# EasyEDA Pro project head_board.epro, board PCB1
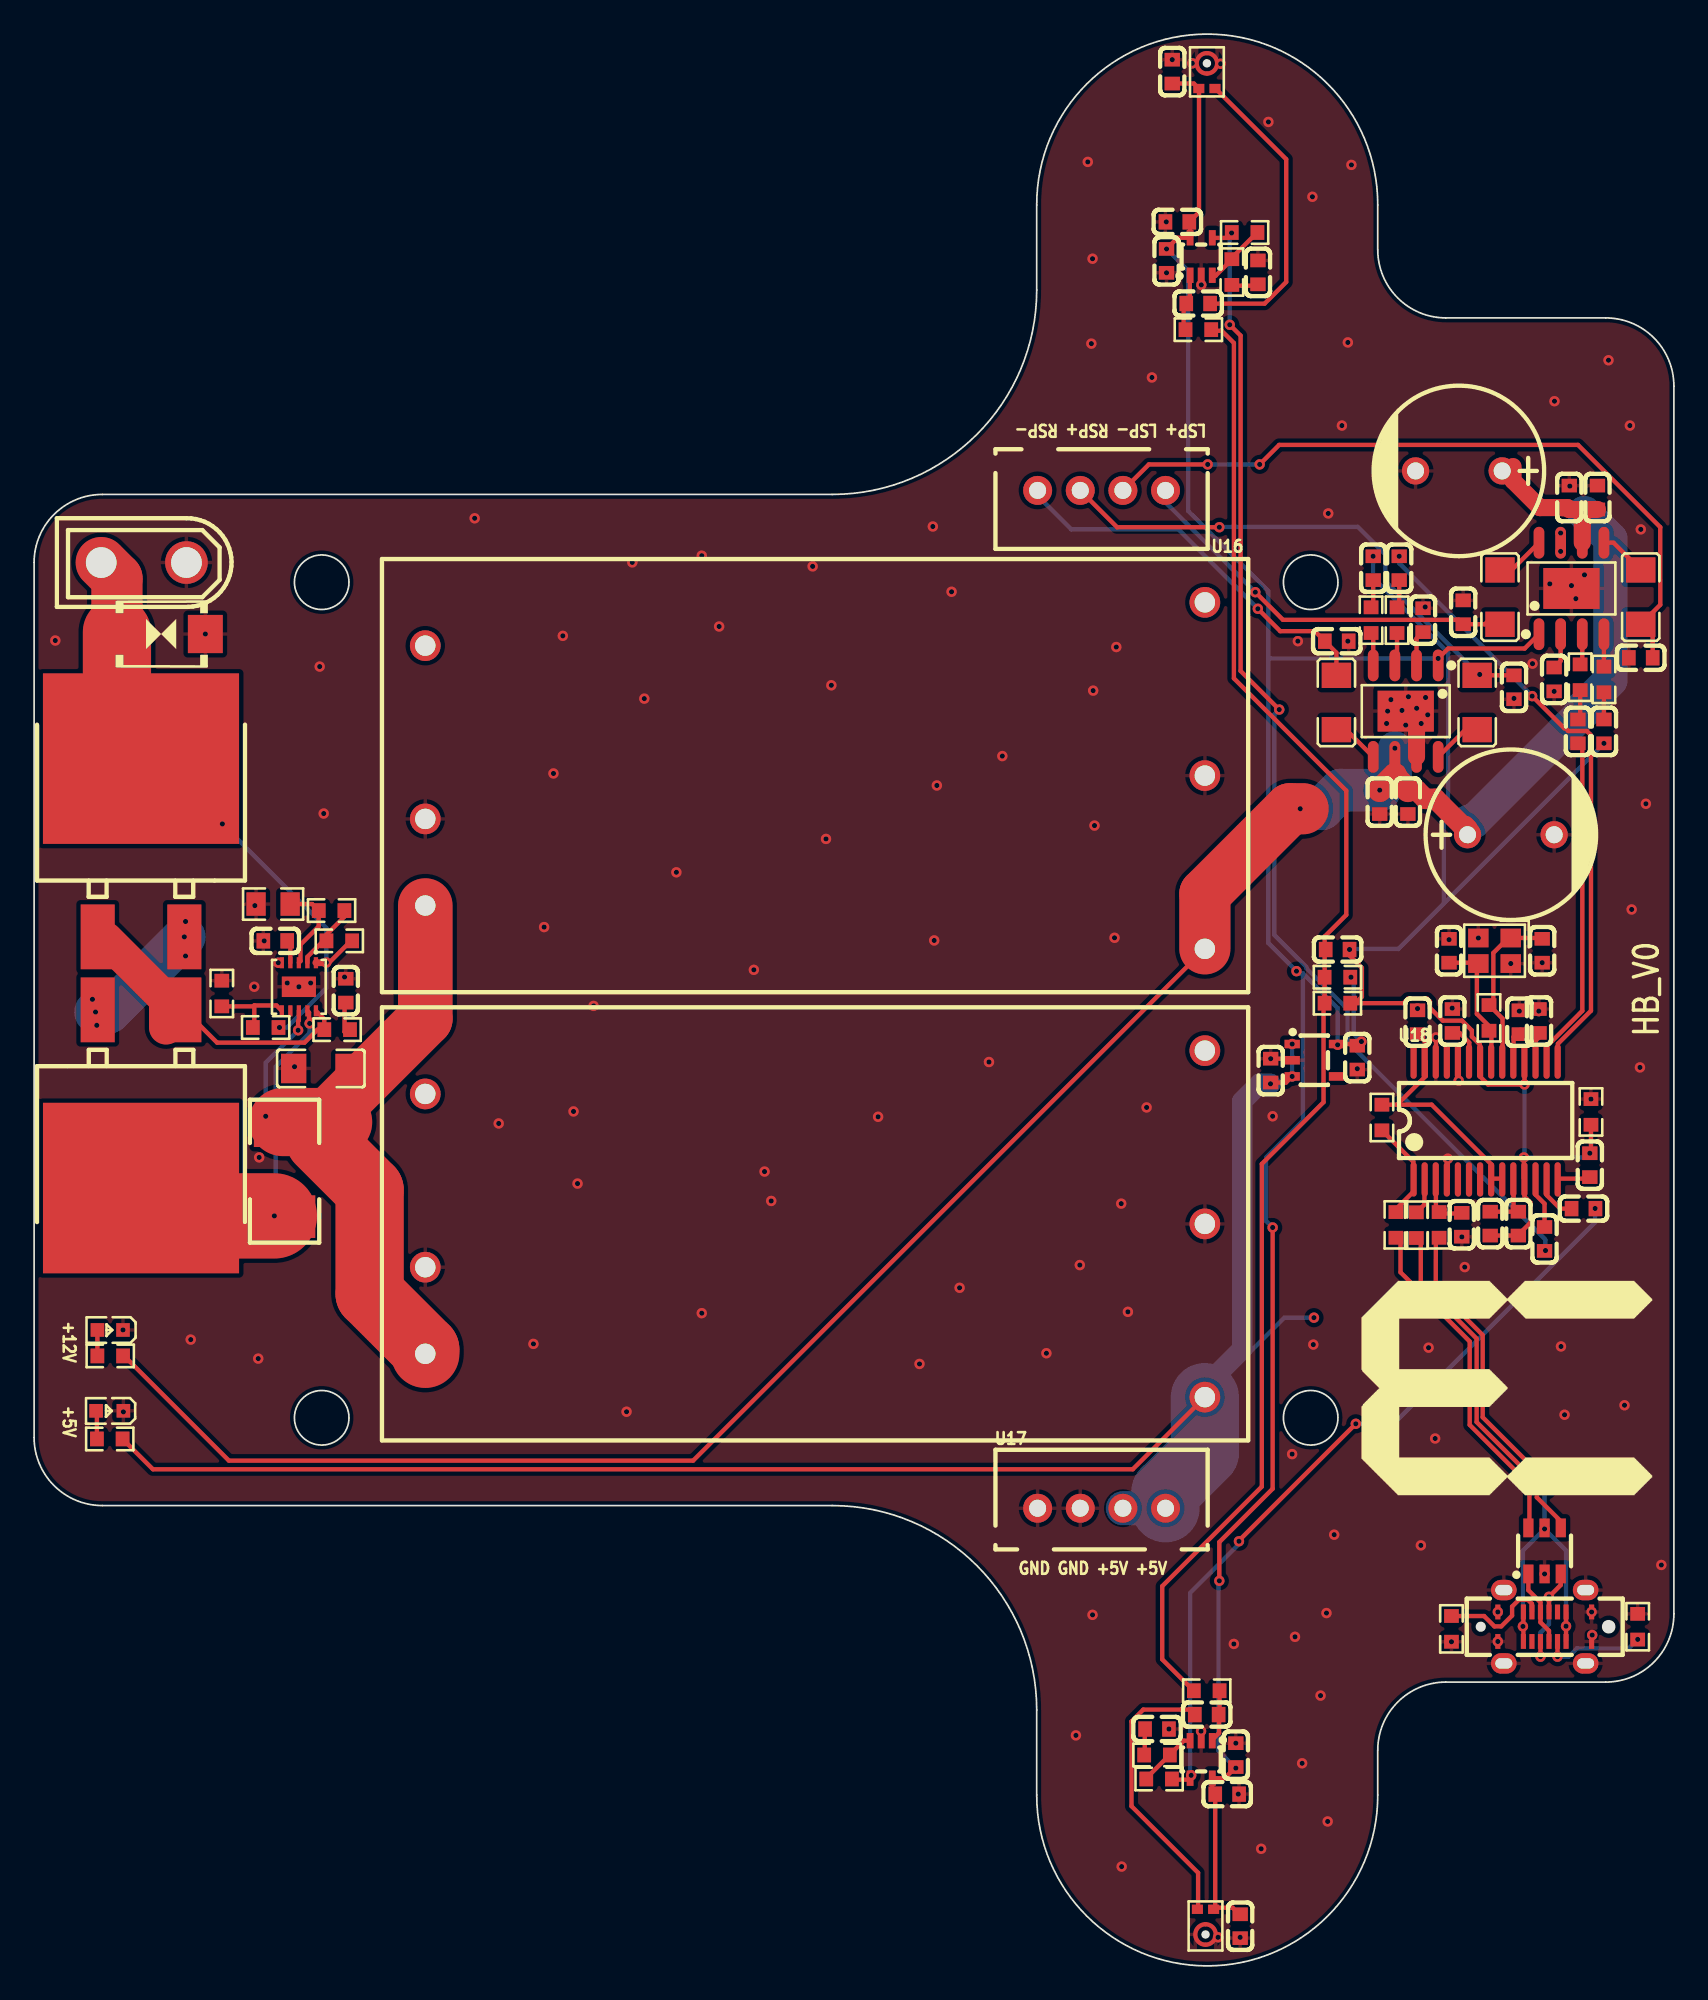
[diagram p1: board, top side]
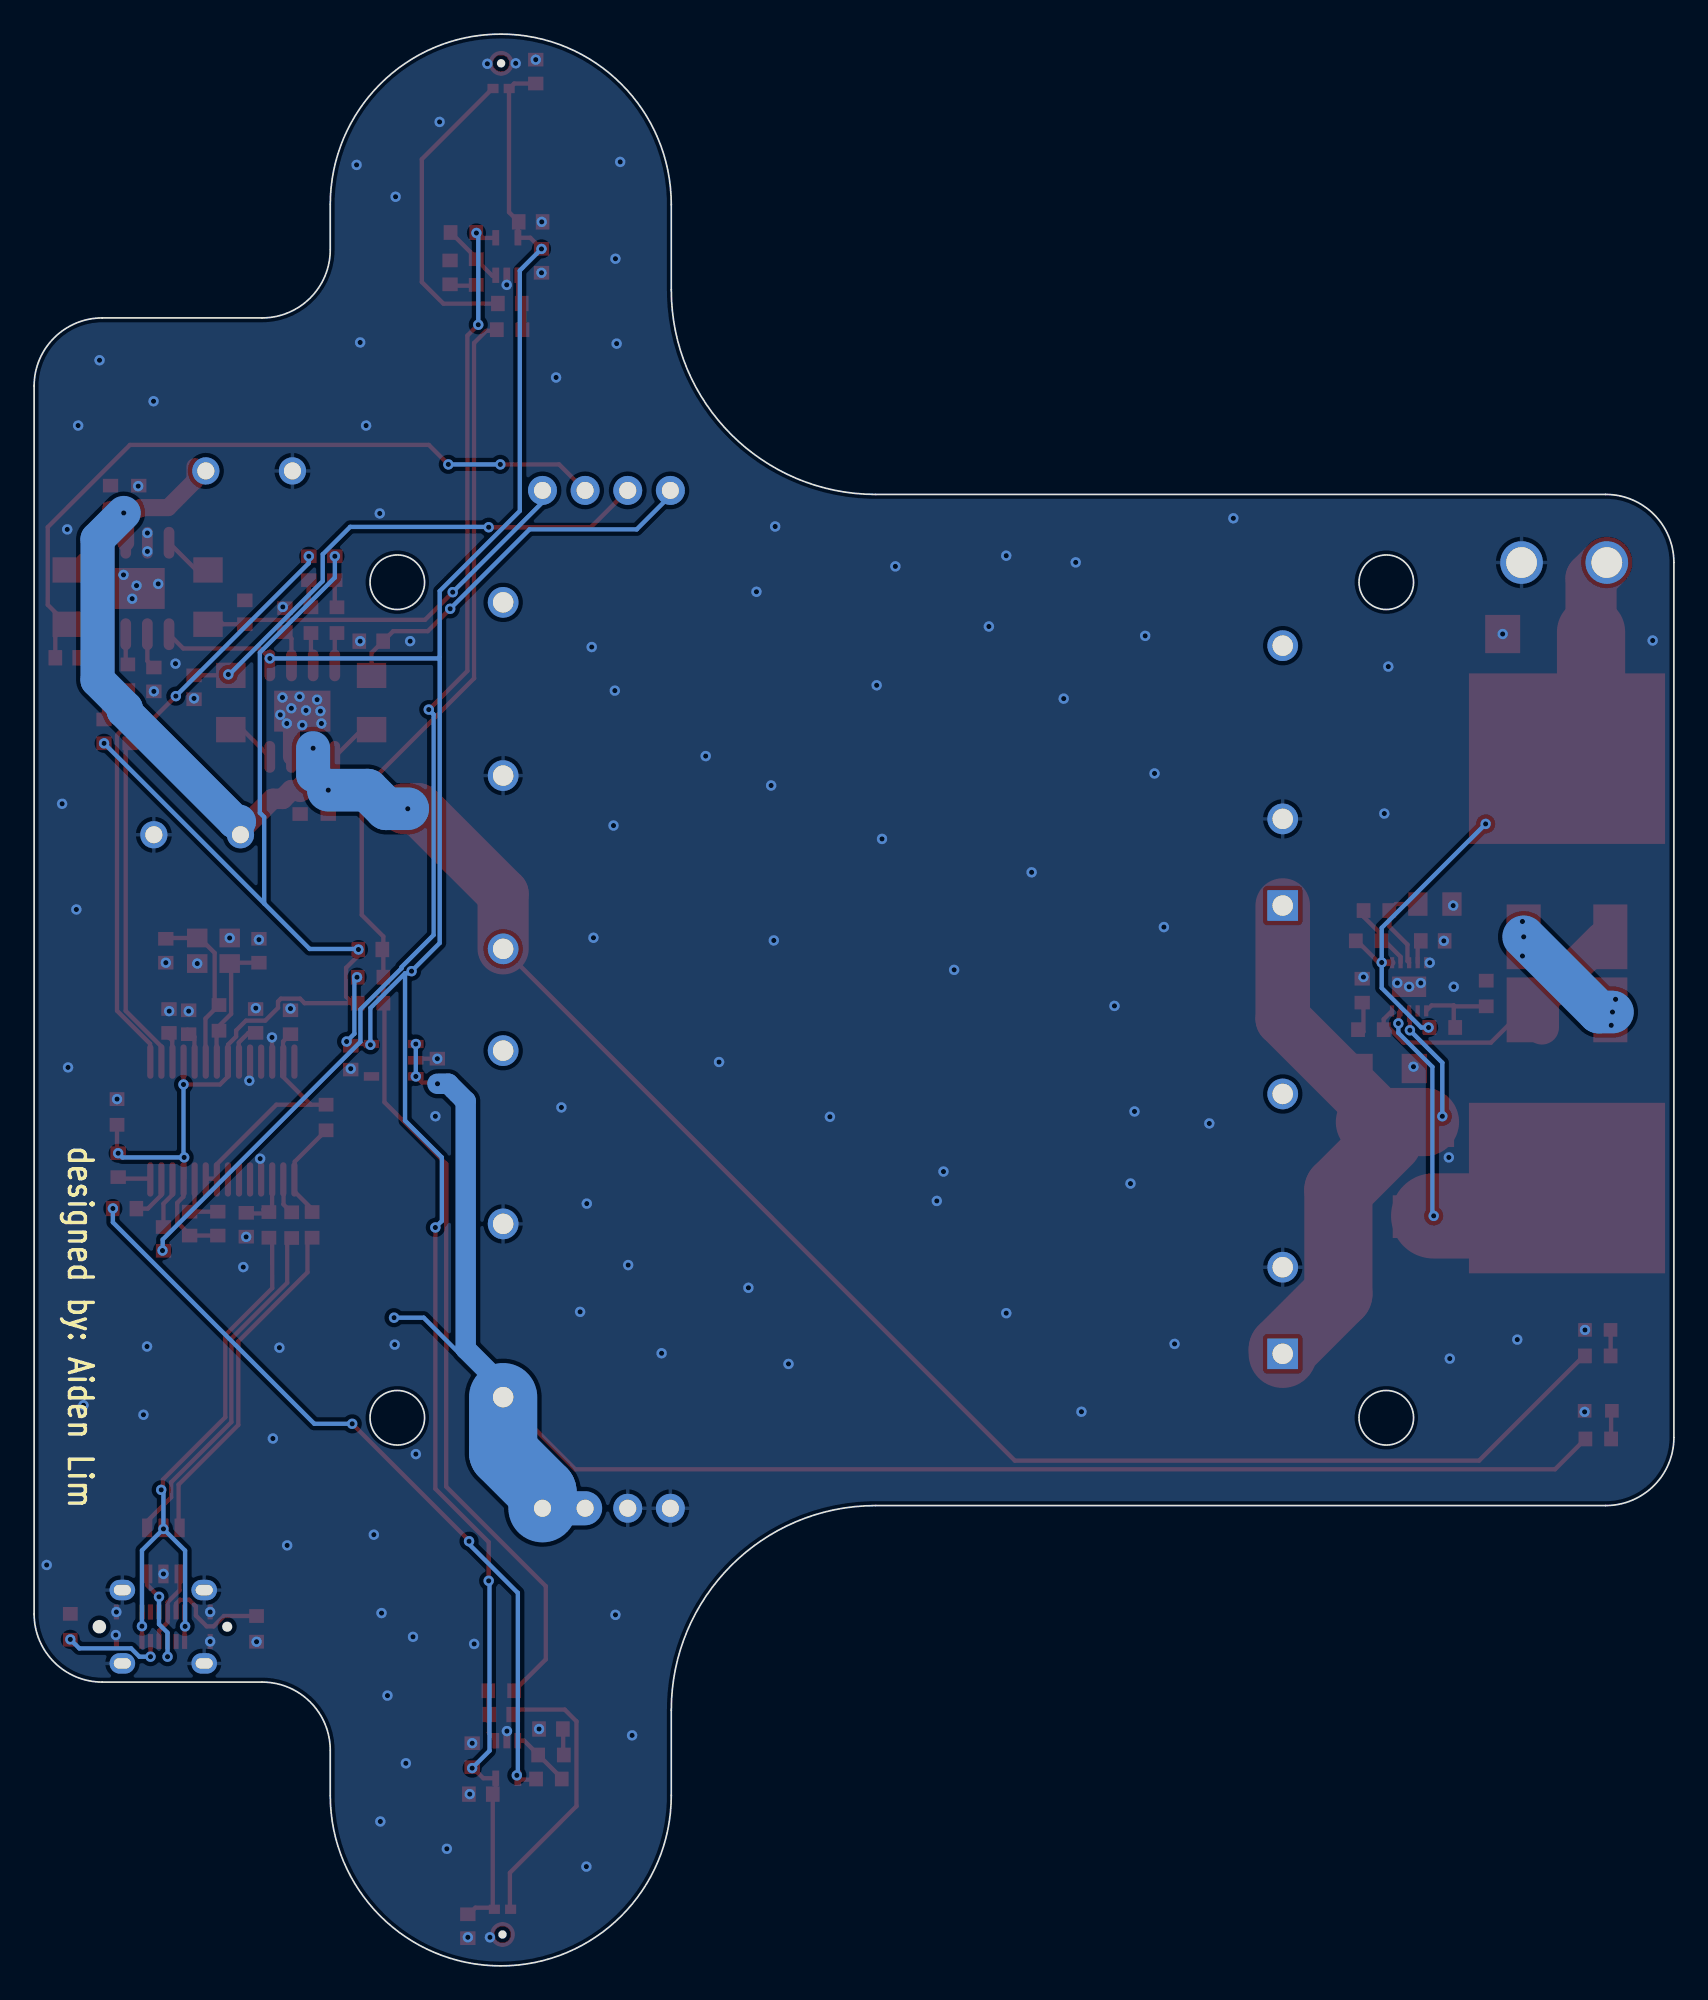
[diagram p2: board, bottom side, seen from below]

Outline 96.17 x 113.29 mm; copper layers: Top Layer, Bottom Layer. Coordinates in mm from the lower left corner of the outline.
Outline path: circle c16.87,81.14 r1.6 ; circle c16.87,32.14 r1.6 ; circle c74.87,81.14 r1.6 ; circle c74.87,32.14 r1.6 ; 0,82.29 0,30.99 arc(1.17,28.17) 4,26.99 46.8,26.99 arc(55.29,23.48) 58.8,14.99 58.8,10 arc(68.8,0) 78.8,10 78.8,12.64 arc(79.97,15.47) 82.8,16.64 92.17,16.64 arc(95,17.81) 96.17,20.64 96.17,92.64 arc(95,95.47) 92.17,96.64 82.8,96.64 arc(79.97,97.81) 78.8,100.64 78.8,103.29 arc(68.8,113.29) 58.8,103.29 58.8,98.29 arc(55.29,89.81) 46.8,86.29 4,86.29 arc(1.17,85.12) 0,82.29
Stack: Top Layer 0.035mm / Dielectric1 1.51mm FR4 er 4.5 / Bottom Layer 0.035mm

## Design rules (mm)
net D+: DP1
net D-: DP1
template: Custom Config
spacing copperThickness1oz (default): track to track 0.102, other pairs 0.152 to 0.3
spacing copperThickness2oz: track to track 0.203, other pairs 0.152 to 0.3
track width copperThickness1oz (default): min 0.127, default 0.254, max 6
track width copperThickness2oz: min 0.203, default 0.254, max 2.54
differential pair differentialPair (default): width min 0.127, default 0.254, max 2.54; gap min 0.152, default 0.152
via viaSize (default): diameter min 0.3, default 0.61, max 10; hole min 0.2, default 0.305, max 6.3

## Placement (name value [footprint] x y rotation side)
C1  10uF  [C0603]  71.78 99.31 270 top
C2  100nF  [C0603]  66.75 111.09 90 top
C3  1uF  [C0603]  66.41 99.99 90 top
C4  100nF  [C0603]  67.05 102.28 180 top
C5  4.7uF  [C0603]  77.6 53.26 90 top
C6  10uF  [C0603]  72.52 52.5 90 top
C7  100nF  [C0603]  68.27 97.49 0 top
C8  1uF  [C0603]  76.45 59.6 180 top
C9  10uF  [C0603]  65.86 13.89 180 top
C10  1uF  [C0603]  81.13 55.34 90 top
C11  100nF  [C0603]  70.73 2.33 270 top
C12  1uF  [C0603]  70.48 12.36 270 top
C13  100nF  [C0603]  69.97 10.07 0 top
C14  1uF  [C0603]  83.73 43.46 90 top
C15  1uF  [C0603]  83.18 55.41 90 top
C16  12pF  [C0603]  82.98 59.53 90 top
C17  100nF  [C0603]  68.77 14.74 180 top
C18  1uF  [C0603]  87.1 55.34 90 top
C19  12pF  [C0603]  88.44 59.53 270 top
C20  100nF  [C0603]  85.4 43.53 90 top
C21  10uF  [C0603]  87.05 43.53 270 top
C22  1uF  [C0603]  88.26 55.41 90 top
C23  1uF  [C0603]  88.58 42.63 90 top
C24  1uF  [C0603]  90.87 44.41 180 top
C25  10uF  [C0603]  91.24 46.96 90 top
C26  1nF  [C0603]  86.79 74.98 270 top
C27  1uF  [C0603]  81.46 78.92 270 top
C28  1uF  [C0603]  78.92 68.25 90 top
C29  1nF  [C0603]  80.57 68.25 90 top
C30  470uF  [CAP-TH_BD10.0-P5.00-D1.0-FD]  86.61 66.33 0 top
C32  100nF  [C0603]  80.06 81.97 270 top
C33  100nF  [C0603]  78.53 81.97 270 top
C34  1nF  [C0603]  76.4 77.69 180 top
C36  1uF  [C1206]  16.82 52.63 0 top
C37  220nF  [C0603]  14.14 60.11 0 top
C38  1uF  [C0603]  89.14 75.44 90 top
C39  1uF  [C0603]  91.68 86.11 270 top
C40  1nF  [C0603]  90.03 86.11 270 top
C41  470uF  [CAP-TH_BD10.0-P5.00-D1.0-FD]  83.56 87.67 180 top
C42  100nF  [C0603]  90.54 72.39 90 top
C43  100nF  [C0603]  92.07 72.39 90 top
C44  1nF  [C0603]  94.22 76.71 0 top
C45  1nF  [C0603]  83.81 79.38 90 top
C47  3.3nF  [C0603]  18.28 57.19 270 top
CN1  XT30UPB-M  [CONN-TH_XT30UPB-M]  6.44 82.3 180 top
D1  TPUSBLC6-2SC6  [SOT-23-6_L2.9-W1.6-P0.95-LS2.8-BR]  88.58 24.34 270 top
D2  SMBJ58CA  [SMB_L4.6-W3.6-LS5.4-BI]  7.45 78.11 0 top
FB1  BLM31PG601SN1L  [L1206]  84.63 74.09 90 top
FB2  BLM31PG601SN1L  [L1206]  76.38 74.09 270 top
FB3  BLM31PG601SN1L  [L1206]  94.22 80.27 90 top
FB4  BLM31PG601SN1L  [L1206]  85.97 80.27 270 top
LED1  KT-0603R  [LED0603-RD#2]  4.44 32.55 180 top
LED2  KT-0603B  [LED0603-RD]  4.47 37.29 180 top
Q1  XC6220B331MR-G  [SOT-25_L3.0-W1.6-P0.95-LS2.8-TL]  75.08 53.11 0 top
Q2  PSMN4R8-100BSEJ  [SOT404_L11.0-W10.0-P2.54-LS15.3-BR]  6.27 65.57 270 top
Q3  PSMN4R8-100BSEJ  [SOT404_L11.0-W10.0-P2.54-LS15.3-BR]  6.27 50.84 90 top
R1  5.1kΩ  [R0603]  94.04 19.89 90 top
R2  51kΩ  [R0603]  70.99 101.65 0 top
R3  1kΩ  [R0603]  70.24 99.33 270 top
R4  5.1kΩ  [R0603]  83.12 19.76 90 top
R5  10kΩ  [R0603]  76.44 57.98 0 top
R6  100kΩ  [R0603]  68.28 95.95 180 top
R7  10kΩ  [R0603]  76.44 56.46 180 top
R8  22Ω  [R0603]  81.06 43.44 90 top
R9  22Ω  [R0603]  79.86 43.45 90 top
R10  1.5kΩ  [R0603]  79.05 49.75 90 top
R11  51kΩ  [R0603]  65.98 10.96 180 top
R12  1kΩ  [R0603]  65.86 12.37 180 top
R13  2.2Ω  [R0603]  82.4 43.45 90 top
R14  1MΩ  [R0603]  85.32 55.59 270 top
R15  100kΩ  [R0603]  68.77 16.13 0 top
R16  20kΩ  [R0603]  79.93 78.92 270 top
R17  20kΩ  [R0603]  78.41 78.92 270 top
R18  22kΩ  [R0603]  17.77 54.9 180 top
R19  1kΩ  [R0603]  4.44 30.9 180 top
R20  3kΩ  [R0603]  4.47 35.77 0 top
R22  5mΩ  [RES-SMD_L6.4-W3.2_LR2512D-3W-1MR]  14.69 46.6 270 top
R23  9.53kΩ  [R0603]  17.45 61.89 0 top
R24  20kΩ  [R0805]  14.02 62.27 0 top
R26  1MΩ  [R0603]  13.58 55.03 0 top
R27  100kΩ  [R0603]  11.01 57.02 90 top
R28  20kΩ  [R0603]  92.07 75.44 90 top
R29  20kΩ  [R0603]  90.67 75.57 90 top
R30  0Ω  [R0603]  91.31 50.08 270 top
R31  2.37MΩ  [R0603]  17.9 60.11 0 top
U1  TYPE-C 16P LTH6.8  [USB-C-SMD_TYPE-C-16P-LTH6.8]  88.59 19.89 0 top
U2  GTA2718B-3HA  [MIC-SMD_3P-L2.8-W1.9_AP1688]  68.78 110.83 180 top
U3  TLV9061IDCKR  [SC-70-5_L2.1-W1.3-P0.65-LS2.2-BR]  68.45 100.24 270 top
U5  GTA2718B-3HA  [MIC-SMD_3P-L2.8-W1.9_AP1688]  68.7 2.58 0 top
U6  TLV9061IDCKR  [SC-70-5_L2.1-W1.3-P0.65-LS2.2-BR]  68.45 12.11 90 top
U7  NS4110B  [ESOP-8_L4.9-W3.9-P1.27-LS6.0-BL-EP-1]  80.44 73.58 180 top
U9  LTC4368CDD-2#PBF  [DFN-10_L3.0-W3.0-P0.50-BL-EP]  15.53 57.42 180 top
U10  100kHz  [PWRM-TH_TURBXXXXLD-30WR3]  45.8 43.51 0 top
U13  300kHz  [PWRM-TH_TURBXXXXLD-30WR3]  45.8 69.8 0 top
U14  NS4110B  [ESOP-8_L4.9-W3.9-P1.27-LS6.0-BL-EP-1]  90.16 80.78 0 top
U16  B4B-XH-A(LF)(SN)  [CONN-TH_B4B-XH-A-LF-SN]  62.6 86.53 180 top
U17  B4B-XH-A(LF)(SN)  [CONN-TH_B4B-XH-A-LF-SN]  62.6 26.84 0 top
U18  PCM2900CDBR  [SSOP-28_L10.2-W5.3-P0.65-LS7.8-BL]  85.13 49.58 0 top
X1  12MHz  [CRYSTAL-SMD_4P-L2.5-W2.0-BL-2]  85.65 59.53 180 top

## Footprints (pads in the part's own frame, mm; a bottom-side part is the same pattern mirrored in y, then rotated)
C0603
  rect 0.8x0.9 smd: 1(-0.7,0) 2(0.7,0)
C1206
  rect 1.485x1.728 smd: 1(-1.593,0) 2(1.593,0)
CAP-TH_BD10.0-P5.00-D1.0-FD
  round 1.6 hole 1: 1(-2.54,0) 2(2.54,0)
CONN-TH_B4B-XH-A-LF-SN
  round 1.7 hole 1: 1(3.75,0) 2(1.25,0) 3(-1.25,0) 4(-3.75,0)
CONN-TH_XT30UPB-M
  round 2.5 hole 1.8: 1(-2.5,0) 2(2.5,0)
CRYSTAL-SMD_4P-L2.5-W2.0-BL-2
  rect 1.2x1.1 smd: 1(-0.95,-0.75) 2(0.95,-0.75) 3(0.95,0.75) 4(-0.95,0.75)
DFN-10_L3.0-W3.0-P0.50-BL-EP
  rect 0.25x0.65 smd: 1(-1,-1.411) 2(-0.5,-1.411) 3(0,-1.411) 4(0.5,-1.411) 5(1,-1.411) 6(1,1.411) 7(0.5,1.411) 8(0,1.411) 9(-0.5,1.411) 10(-1,1.411)
  rect 2x1.2 smd: 11(0,0)
ESOP-8_L4.9-W3.9-P1.27-LS6.0-BL-EP-1
  oval 0.63x1.865 smd: 1(-1.905,-2.683) 2(-0.635,-2.683) 3(0.635,-2.683) 4(1.905,-2.683) 5(1.905,2.683) 6(0.635,2.683) 7(-0.635,2.683) 8(-1.905,2.683)
  rect 3.3x2.4 smd: 9(0,0)
L1206
  rect 1.485x1.728 smd: 1(-1.593,0) 2(1.593,0)
LED0603-RD
  rect 0.8x0.8 smd: 1(-0.749,0) 2(0.749,0)
LED0603-RD#2
  rect 0.8x0.8 smd: 1(-0.799,0) 2(0.799,0)
MIC-SMD_3P-L2.8-W1.9_AP1688
  rect 0.65x0.545 smd: 1(0.475,0.739) 2(-0.475,0.739)
  custom 0.849x1.45 smd: 3(-0.6,-0.739) 3(0.6,-0.739)
PWRM-TH_TURBXXXXLD-30WR3
  rect 1.8x1.8 hole 1.2: 1(-22.86,-7.62)
  round 1.8 hole 1.2: 2(-22.86,-2.54) 3(-22.86,7.62) 4(22.86,10.16) 5(22.86,0) 6(22.86,-10.16)
R0603
  rect 0.806x0.864 smd: 1(-0.753,0) 2(0.753,0)
R0805
  rect 1.133x1.377 smd: 1(-1,0) 2(1,0)
RES-SMD_L6.4-W3.2_LR2512D-3W-1MR
  rect 2.5x3.6 smd: 1(-2.667,0) 2(2.667,0)
SC-70-5_L2.1-W1.3-P0.65-LS2.2-BR
  rect 0.9x0.4 smd: 1(1.1,-0.65) 2(1.1,0) 3(1.1,0.65) 4(-1.1,0.65) 5(-1.1,-0.65)
SMB_L4.6-W3.6-LS5.4-BI
  rect 2.047x2.241 smd: 1(-2.591,0) 2(2.591,0)
SOT404_L11.0-W10.0-P2.54-LS15.3-BR
  rect 3.8x1.999 smd: 1(5.225,-2.54) 3(5.225,2.54)
  rect 10x11.501 smd: 2(-5.225,-0.001)
SOT-23-6_L2.9-W1.6-P0.95-LS2.8-BR
  rect 1.1x0.6 smd: 1(1.35,-0.95) 2(1.35,0) 3(1.35,0.95) 4(-1.35,0.95) 5(-1.35,0) 6(-1.35,-0.95)
SOT-25_L3.0-W1.6-P0.95-LS2.8-TL
  rect 0.9x0.5 smd: 1(-1.3,0.95) 2(-1.3,0) 3(-1.3,-0.95) 4(1.3,-0.95) 5(1.3,0.95)
SSOP-28_L10.2-W5.3-P0.65-LS7.8-BL
  oval 0.364x2.015 smd: 1(-4.225,-3.455) 2(-3.575,-3.455) 3(-2.925,-3.455) 4(-2.275,-3.455) 5(-1.625,-3.455) 6(-0.975,-3.455) 7(-0.325,-3.455) 8(0.325,-3.455) 9(0.975,-3.455) 10(1.625,-3.455) 11(2.275,-3.455) 12(2.925,-3.455) 13(3.575,-3.455) 14(4.225,-3.455) 15(4.225,3.455) 16(3.575,3.455) 17(2.925,3.455) 18(2.275,3.455) 19(1.625,3.455) 20(0.975,3.455) 21(0.325,3.455) 22(-0.325,3.455) 23(-0.975,3.455) 24(-1.625,3.455) 25(-2.275,3.455) 26(-2.925,3.455) 27(-3.575,3.455) 28(-4.225,3.455)
USB-C-SMD_TYPE-C-16P-LTH6.8
  oval 1.5x1.2 hole 1x0.61: 1(-2.4,2.15) 2(-2.4,-2.15) 3(2.4,2.15) 4(2.4,-2.15)
  rect 0.3x0.87 smd: A1(-2.75,0.865) A4(-1.25,0.865) A5(-0.75,0.865) A6(-0.25,0.865) A7(0.25,0.865) A8(0.75,0.865) A9(1.25,0.865) A12(2.75,0.865) B1(2.75,-0.865) B4(1.25,-0.865) B5(0.75,-0.865) B6(0.25,-0.865) B7(-0.25,-0.865) B8(-0.75,-0.865) B9(-1.25,-0.865) B12(-2.75,-0.865)

## Nets
As in the schematic.

Pads without a net: Q1 4; U1 A8 B8; U9 7; U10 3 4; U13 3 4; U18 5 6 7 25 28

## Via types
v1: diameter 0.61, hole 0.305, Top Layer to Bottom Layer, 213 vias

## Routing (per net, layer and track width the routed paths; a pad name or vN(x,y) marks a point on that pad's centre or on a via; arc(x,y) is an arc through that point)
+3.3V: length 146
  Top Layer w0.254: 68.32,110.08 68.43,109.97 ; 68.32,110.08 U2.1 68.01,110.39 C2.1 ; 68.32,110.08 68.32,102.85 C4.1 67.8,102.23 U3.5 67.07,101.34 v1(66.41,100.69) ; 69.27,3.41 C13.1 69.1,10.25 U6.5 69.82,11.01 C12.2 ; 69.27,3.41 U5.1 ; 69.27,3.41 70.29,3.41 70.67,3.03 C11.1 ; v1(82.34,76.67) 82.93,77.26 87.42,77.26 U14.1 ; v1(77.84,54.21) 77.7,54.06 Q1.5 ; v1(72.64,43.3) 72.64,27.98 69.51,24.85 v1(69.51,22.58)
  Bottom Layer w0.254: v1(76.45,54.02) 76.45,56.17 74.41,58.21 ; 72.38,76.76 72.38,80.62 67.68,85.32 67.68,99.42 v1(66.41,100.69) ; 72.38,76.76 72.47,76.67 v1(82.34,76.67) ; 72.38,76.76 72.38,59.98 v1(74.03,58.33) 74.16,58.21 74.41,58.21 ; v1(70.48,11.6) 69.46,12.61 69.46,22.53 v1(69.51,22.58) ; 74.41,58.21 74.41,49.57 72.26,47.41 72.26,43.68 v1(72.64,43.3) ; v1(77.84,54.21) 77.39,54.66 77.39,57.82 v1(77.23,57.98)
+5V: length 103.6
  Top Layer w0.254: R19.1 6.97,29.12 64.43,29.12 U10.6 ; v1(73.78,52.16) 73.42,51.8 C6.1
  Bottom Layer w0.254: v1(75.06,38.01) 73.32,38.01 71.29,35.98 ; v1(73.78,54.06) v1(73.78,52.16)
  Bottom Layer w1.2: 68.66,33.99 70.86,36.19 70.86,50.71 71.87,51.73 v1(72.51,51.73)
  Bottom Layer w2: U17.2 U17.1
  Bottom Layer w4: U10.6 68.66,30.1 66.35,27.79 U17.1
+12V: length 136.6
  Top Layer w0.254: U7.6 79.81,69.84 ; R20.2 5.28,35.77 11.42,29.63 38.65,29.63 U13.6
  Top Layer w1: 90.83,85.41 90.8,85.37 U14.6 ; 90.83,85.41 C39.2 ; 90.83,85.41 C40.2 89.93,85.52 88.31,85.52 86.73,87.1 86.73,87.92
  Top Layer w1.2: C29.2 81.08,68.95 81.59,68.44 82.18,68.44 83.77,66.85 83.89,66.85 84.07,66.68 C30.1
  Top Layer w1.4: v1(78.92,68.95) 79.81,69.84 79.81,69.71 C29.2
  Top Layer w3: U13.6 68.66,62.87 73.65,67.86 74.42,67.86
  Bottom Layer w1.5: v1(78.92,68.95) 79.81,69.84
  Bottom Layer w2: 79.81,69.84 v1(79.81,71.41) ; 84.15,67.11 84.4,67.11 90.92,73.62 90.8,73.75 92.45,75.4 92.45,83.67 v1(90.91,85.2)
  Bottom Layer w2.5: v1(74.25,67.86) 75.52,67.86 76.62,68.95 v1(78.92,68.95)
AGND: length 77.7
  Top Layer w0.254: v1(87.37,47.41) 87.37,46.22 87.42,46.17 87.42,45.1 87.78,44.74 87.78,43.61 87.05,42.88 ; 77.49,56.46 R7.1 ; 77.49,56.46 80.31,56.46 80.57,56.72 81.69,56.72 81.86,56.56 81.86,56.18 82.61,55.43 83.74,55.43 84.32,54.86 84.32,54.5 84.79,54.03 84.79,52.16 85.26,51.69 v1(87.41,51.69) 87.41,53.07 87.42,53.08 ; 77.49,56.46 77.87,56.84 77.87,58.53 77.15,59.25 v1(77.15,59.6) ; R30.2 91.31,47.72 v1(91.24,47.66) ; 85.4,42.83 87.05,42.83
  Bottom Layer w0.254: v1(87.41,51.69) 87.41,47.45 v1(87.37,47.41) 90.99,47.41 v1(91.24,47.66) ; 77.21,59.64 80.01,59.64 82.68,62.3 ; v1(92.07,71.69) 82.68,62.3 ; 82.68,62.3 82.68,67.37 82.93,67.62 82.93,77.02 78.53,81.42 v1(78.53,82.67)
GND: length 7.1
  Top Layer w0.254: v1(82.91,47.34) 82.91,46.21 82.87,46.17 ; Q1.2 73.69,53.2 v1(72.52,53.2) ; 83.52,53.08 83.55,53.05 v1(83.55,51.91) ; 82.22,53.08 v1(82.22,54.45)
  Top Layer w1: U7.7 81.07,72.58 v1(81.35,72.86)
  vias: v1(1.24,77.72) v1(5.21,37.29) v1(5.24,32.49) v1(9.19,36.73) v1(10.04,78.11) v1(12.91,57.42) v1(12.94,62.18) v1(13.2,47.41) v1(13.15,35.61) v1(13.49,60.11) v1(14.32,58.83) v1(14.85,57.64) v1(15.27,52.73) v1(15.53,57.42) v1(16.22,57.64) v1(16.75,76.2) v1(16.98,67.58) v1(18.21,57.99) v1(25.84,84.89) v1(27.25,49.4) v1(29.28,36.48) v1(29.91,60.92) v1(30.46,69.93) v1(31.01,78) v1(31.63,50.11) v1(31.87,45.88) v1(32.81,56.3) v1(34.75,32.5) v1(35.08,82.31) v1(35.79,74.32) v1(37.67,64.13) v1(39.16,82.7) v1(39.16,38.28) v1(40.17,78.55) v1(42.21,58.41) v1(42.84,46.58) v1(43.23,44.86) v1(45.66,82.07) v1(46.44,66.09) v1(46.76,75.1) v1(49.5,49.79) v1(51.93,35.3) v1(52.71,84.41) v1(52.79,60.14) v1(52.94,69.22) v1(53.81,80.58) v1(54.28,39.77) v1(56,53.01) v1(56.78,70.95) v1(59.37,35.93) v1(61.1,13.52) v1(61.33,41.1) v1(61.8,105.79) v1(62,95.14) v1(62.07,100.11) v1(62.11,74.79) v1(62.07,20.59) v1(62.19,66.87) v1(63.36,60.29) v1(63.47,77.34) v1(63.76,44.7) v1(63.78,5.82) v1(64.15,38.36) v1(65.24,50.34) v1(65.56,93.15) v1(66.4,102.28) v1(66.41,99.29) v1(66.56,13.89) v1(66.75,111.79) v1(67.93,111.57) v1(68.45,98.58) v1(68.44,13.77) v1(69.44,1.68) v1(69.59,111.55) v1(70.36,18.88) v1(70.48,13.06) v1(70.62,10.07) v1(70.73,1.68) v1(71.96,6.87) v1(72.39,108.14) v1(72.64,49.82) v1(73.78,30.01) v1(73.95,19.3) v1(74.12,77.69) v1(74.37,11.88) v1(74.97,103.75) v1(75.02,36.44) v1(75.44,15.85) v1(75.79,20.69) v1(75.9,85.18) v1(75.86,8.47) v1(76.25,25.29) v1(76.7,90.33) v1(77.05,95.2) v1(77.05,77.69) v1(77.26,105.62) v1(77.6,52.61) v1(79.32,72.86) v1(79.38,73.58) v1(79.57,74.26) v1(80.22,73.63) v1(80.44,72.76) v1(80.6,74.43) v1(81.08,73.75) v1(81.13,56.14) v1(81.33,24.66) v1(81.58,79.69) v1(81.6,74.38) v1(81.73,73.37) v1(81.78,36.25) v1(82.17,30.93) v1(82.98,60.18) v1(83.12,19.01) v1(83.17,56.17) v1(83.73,42.75) v1(83.9,40.98) v1(84.7,60.28) v1(85.84,20.75) v1(85.84,19.02) v1(86.6,58.78) v1(86.79,74.33) v1(87.1,55.99) v1(87.88,76.37) v1(88.25,55.99) v1(88.44,58.83) v1(88.58,22.99) v1(88.89,81.05) v1(89.16,91.76) v1(89.14,74.74) v1(89.53,84.03) v1(89.53,82.95) v1(89.55,36.32) v1(89.76,32.32) v1(90.06,86.78) v1(90.16,80.95) v1(90.42,80.18) v1(90.92,81.57) v1(91.31,50.83) v1(91.34,20.75) v1(91.38,19.4) v1(92.33,94.16) v1(93.27,32.88) v1(93.59,90.33) v1(93.69,61.95) v1(94.23,84.24) v1(94.18,52.69) v1(94.53,68.15) v1(95.43,23.51)
VBUS: length 35.8
  Top Layer w0.254: 87.34,20.75 U1.B9 ; 82.39,42.69 82.21,42.5 82.2,39.75 84.96,36.99 84.96,32.17 88.61,28.51 88.61,28.02 v1(88.71,27.92) ; U1.B4 v1(89.84,19.92) 89.84,20.75
  Bottom Layer w0.254: v1(88.71,27.92) 88.58,27.79 v1(88.58,25.62) ; v1(88.58,25.62) 89.84,24.37 v1(89.84,19.92) ; v1(88.58,25.62) 87.31,24.35 v1(87.31,19.91)
VIN: length 30.7
  Top Layer w0.254: 18.58,60.11 17.31,58.84
  Top Layer w0.4: U9.1 17.12,58.83 v1(17.14,58.84)
  Top Layer w3: CN1.2 4.86,81.37 4.86,78.23
  Top Layer w4: 6.27,70.8 4.86,72.21 4.86,78.23
  Bottom Layer w0.254: v1(14.39,55.03) 14.82,55.03 17.14,57.35 v1(17.14,58.84) 17.14,60.87 v1(11.04,66.97)
VIN_PROTECTED: length 42.2
  Top Layer w0.254: U9.8 15.53,55.45 15.48,55.41 v1(15.48,54.87)
  Top Layer w3: 16.76,48.42 16.76,48.05
  Top Layer w3.2: 16.42,49.04 16.44,49.04 22.94,55.54 U13.1 ; 17.26,49.19 17.26,49.21 17.54,49.49 ; 16.76,48.7 16.76,48.42
  Top Layer w4: 14.6,49.49 17.83,49.49 ; U10.1 22.94,36.15 19.68,39.41 19.68,45.5 16.76,48.42
  Bottom Layer w0.254: v1(13.58,49.82) 13.58,52.97 v1(15.48,54.87)
D+: length 20.3
  Top Layer w0.254: D1.6 87.69,25.75 87.69,28.22 84.19,31.72 84.19,36.62 80.14,40.67 80.14,42.43 79.94,42.63 79.85,42.63
D-: length 20.5
  Top Layer w0.254: D1.4 89.53,26.07 88.13,27.48 88.13,28.36 84.6,31.89 84.6,36.78 81.32,40.06 81.32,42.4 81.06,42.67
DN: length 7.1
  Top Layer w0.254: D1.3 89.53,22.34 v1(88.84,21.65) 88.84,20.75 ; v1(88.34,18.13) U1.B7
  Bottom Layer w0.254: v1(88.34,18.13) 88.34,19.54 88.84,20.04 v1(88.84,21.65)
DP: length 4.5
  Top Layer w0.254: D1.1 87.63,22.03 88.34,21.32 88.34,20.15 88.84,19.65 U1.B6
L_MICOUT: length 18.1
  Top Layer w0.254: U2.2 69.28,110.1 73.43,105.95 73.43,98.75 72.16,97.48 68.97,97.48
L_PAMP_OUT: length 69
  Top Layer w0.254: v1(73.02,73.67) 70.76,75.94 70.76,95.61 v1(70.12,96.24) ; 70.23,101.57 70,101.33 69.09,101.33
  Bottom Layer w0.254: v1(73.02,73.67) 72.74,73.39 72.74,60.45 74.62,58.58 74.62,58.51 77.03,56.09 77.03,54.19 88.63,42.6 88.63,41.88 ; v1(70.12,96.24) 70.12,101.56 70.22,101.66
  vias: v1(70.23,101.62) v1(88.64,41.95)
LAMP_IN+: length 19.6
  Top Layer w0.254: 88.72,53.08 88.72,53.93 90.8,56.01 90.8,71.44 C42.1
LSP+: length 22.9
  Top Layer w0.254: v1(71.62,80.56) 73.24,78.94 83.55,78.94 C45.1 85.08,78.68 85.46,79.06
  Bottom Layer w0.254: U16.4 66.35,85.83 v1(71.62,80.56)
LSP-: length 43
  Top Layer w0.254: v1(68.83,88.05) 65.38,88.05 U16.3 ; C44.2 94.92,77.98 FB3.1 95.37,79.82 95.37,84.37 90.55,89.19 73.02,89.19 v1(71.87,88.05)
  Bottom Layer w0.254: v1(71.87,88.05) v1(68.83,88.05)
R_MICOUT: length 16.7
  Top Layer w0.254: U5.2 68.26,3.36 68.26,5.46 64.36,9.37 64.36,14.34 65.05,15.03 67.72,15.03 67.98,14.78
R_PAMP_OUT: length 45.5
  Top Layer w0.254: 70.6,24.87 v1(77.51,31.79) ; 67.87,10.98 67.81,10.92 66.76,10.92
  Bottom Layer w0.254: v1(77.51,31.79) 79.73,31.79 91.55,43.6 v1(91.55,44.42) ; 70.71,24.87 70.71,24.78 67.8,21.88 67.8,11.19
  vias: v1(67.86,11.18) v1(70.66,24.9)
RAMP_IN+: length 35.7
  Top Layer w0.254: 89.37,53.08 89.37,54.07 91.31,56.01 91.31,72.13 91.27,72.17 91.27,72.21 91.06,72.42 89.98,72.42 89.81,72.58 89.74,72.58 v1(87.86,74.46)
  Bottom Layer w0.254: v1(87.86,74.46) 80.06,82.26 v1(80.06,82.67)
RSP+: length 31.2
  Top Layer w0.254: C26.1 86.79,75.68 FB1.2 84.68,75.73 v1(84.78,75.73) ; U16.2 63.51,84.37 v1(69.51,84.37)
  Bottom Layer w0.254: v1(84.78,75.73) 84.72,75.73 79.24,81.21 79.24,82.78 77.63,84.39 69.53,84.39 v1(69.51,84.37)
RSP-: length 23
  Top Layer w0.254: FB2.1 76.38,77.01 C34.2 75.11,78.27 73.08,78.27 v1(71.77,79.59)
  Bottom Layer w0.254: U16.1 58.85,86.21 60.83,84.24 67.11,84.24 v1(71.77,79.59)
VBIAS: length 88.8
  Top Layer w0.254: 68.09,16.05 66.16,17.98 66.16,22.27 72,28.11 72,47.03 75.62,50.65 75.62,56.81 75.69,56.87 75.69,60.37 76.95,61.64 76.95,68.92 70.37,75.51 70.37,95.17 69.65,95.89 68.99,95.89
XTI: length 7.8
  Top Layer w0.254: C16.1 84.48,58.83 84.61,58.69 ; X1.3 84.61,58.69 ; 84.61,58.69 84.61,55.83 85.32,55.12 R14.2 85.47,54.7 85.47,53.08
XTO: length 10
  Top Layer w0.254: 86.12,53.08 86.12,55.55 85.32,56.35 85.58,56.6 85.58,59.4 86.46,60.28 X1.1 88.39,60.28 C19.1
$1N1209: length 2.1
  Top Layer w0.254: C27.2 81.07,77.84 U7.2
$1N1306: length 2
  Top Layer w0.254: R16.2 79.93,76.39 U7.3
$1N1321: length 2.9
  Top Layer w0.254: FB1.1 83.94,72.5 U7.8
$1N1334: length 2.8
  Top Layer w0.254: FB2.2 76.94,72.5 U7.5
$1N1854: length 1.6
  Top Layer w0.254: R16.1 80.06,79.8 C32.2
$1N1856: length 1.6
  Top Layer w0.254: R17.1 78.53,79.8 C33.2
$1N1868: length 2
  Top Layer w0.254: R17.2 78.53,78.04 U7.4
$1N3774: length 6
  Top Layer w0.254: v1(89.34,18.13) U1.B5
  Bottom Layer w0.254: v1(89.34,18.13) 89.99,18.13 90.48,18.62 93.52,18.62 v1(94.04,19.15)
$1N3777: length 6.5
  Top Layer w0.254: 87.84,20.75 87.84,21.23 87.61,21.47 87.08,21.47 86.68,21.07 86.68,20.54 86.04,19.91 85.64,19.91 85.04,20.52 83.12,20.52
$1N4352: length 2.2
  Top Layer w0.254: 81.57,46.17 81.57,45.88 81.54,45.85 81.54,44.66 ; 81.07,44.18 81.55,44.66
$1N4384: length 4.2
  Top Layer w0.254: 82.22,46.17 82.21,46.16 82.21,44.49 82.34,44.36 ; 82.34,44.36 82.73,44.36 ; 82.34,44.36 82.11,44.12 83.73,44.12
$1N4605: length 5.3
  Top Layer w0.254: 79.85,44.17 79.85,44.36 80.89,45.4 ; 80.92,46.17 80.88,46.14 80.88,47.16 R10.1
$1N4875: length 14.4
  Top Layer w0.254: 79.94,50.5 81.62,52.18 81.62,53.03 81.57,53.08 81.57,54.21 C10.1 ; 79.94,50.5 81.96,50.5 85.47,47 85.47,46.17 86.12,46.17 ; 79.94,50.5 R10.2
$1N5175: length 2.3
  Top Layer w0.254: 84.17,53.08 84.17,54.15 83.6,54.71 83.18,54.71
$1N5194: length 2
  Top Layer w0.254: 86.77,53.08 86.77,54.49 87.17,54.89
$1N5215: length 1.7
  Top Layer w0.254: 88.07,53.08 88.07,54.26 88.26,54.45 88.26,54.71
$1N5735: length 3.6
  Top Layer w0.254: 86.82,44.23 C21.1 ; 86.82,44.23 86.77,44.28 86.77,46.17 ; 86.82,44.23 C20.2
$1N5788: length 1.9
  Top Layer w0.254: C25.1 91.15,46.17 89.37,46.17
$1N5995: length 2.8
  Top Layer w0.254: 88.72,46.17 88.72,45.19 89.5,44.41 C24.2
$1N6000: length 3.1
  Top Layer w0.254: 88.07,46.17 88.07,45.21 88.58,44.7 C23.2
$1N8779: length 3.5
  Top Layer w0.254: 71.67,101.53 71.61,101.53 70.24,100.16 ; 70.2,100.03 69.29,99.12 69.07,99.12
$1N9196: length 1.8
  Top Layer w0.254: 71.87,98.47 71.8,98.53 70.19,98.53 70.15,98.49
$1N12168: length 5.4
  Top Layer w0.254: R24.2 16.31,62.27 R23.1 16.69,60.96 15.62,59.89 15.62,58.92 U9.3
$1N12172: length 4
  Top Layer w0.254: U9.2 16.03,59.17 16.97,60.11 17.07,60.11 17.07,60.4 18.2,61.53 R23.2
$1N14458: length 7
  Bottom Layer w2.5: v1(8.81,60.35) 4.4,55.94 v1(3.6,55.94)
  vias: v1(3.42,56.68) v1(3.68,55.16) v1(8.88,61.25) v1(8.88,59.22)
$1N14462: length 18.3
  Top Layer w0.254: U9.10 17.02,55.52 R18.2 16.62,54.9 15.86,54.14 10.73,54.14 8.81,56.06
  Top Layer w1.8: 4.08,60.35 4.2,60.22 3.86,60.22 Q2.1 4.08,60.35
  Top Layer w2: 7.74,55.03 7.74,56.68 4.2,60.22
$1N14561: length 1.4
  Top Layer w0.254: U9.4 15.03,59.93 C37.2
$1N14702: length 23.3
  Top Layer w0.254: U9.9 16.12,55.91 16.12,55.57 16.16,55.53 v1(16.16,55.27)
  Top Layer w5: 4.37,45.61 6,43.98 v1(14.09,43.98)
  Bottom Layer w0.254: v1(16.16,55.27) 16.16,54.72 14.17,52.72 14.17,44.06 v1(14.09,43.98)
$1N14991: length 1.7
  Top Layer w0.254: 18.2,54.78 18.21,54.78 18.21,56.49
$1N23337: length 3.4
  Top Layer w0.254: 67.4,97.56 67.42,97.54 67.42,95.89 ; 67.49,97.39 67.78,97.68 67.78,98.97
$1N23752: length 3.5
  Top Layer w0.254: 65.18,10.96 67.43,13.2 67.75,13.2
$1N23753: length 1.4
  Top Layer w0.254: 65.14,12.5 65.14,13.84 65.18,13.88
$1N23760: length 3.2
  Top Layer w0.254: 69.52,16.11 69.52,14.89 ; 69.5,14.69 69.45,14.64 ; 69.5,14.69 69.5,13.66 69.04,13.2 ; 69.5,14.69 69.5,14.89
$1N26679: length 4.9
  Top Layer w0.254: 12.91,56.32 12.91,55.13 ; 12.91,56.32 14.21,56.32 U9.6 ; 12.91,56.32 12.86,56.27 R27.1
$1N27508: length 1.7
  Top Layer w0.254: LED1.2 3.68,32.51 R19.2
$1N27617: length 1.5
  Top Layer w0.254: R20.1 3.71,37.29 LED2.2
$1N42858: length 2.1
  Top Layer w0.254: C38.2 89.53,76.52 U14.2
$1N42862: length 1.8
  Top Layer w0.254: R29.2 90.8,76.45 U14.3
$1N42863: length 2.9
  Top Layer w0.254: FB4.1 86.66,81.86 U14.8
$1N42864: length 2.8
  Top Layer w0.254: U14.5 92.63,83.46 FB3.2
$1N42868: length 1.8
  Top Layer w0.254: 90.67,74.82 90.67,73.22 C42.2
$1N42869: length 1.6
  Top Layer w0.254: R28.1 C43.2
$1N42870: length 1.9
  Top Layer w0.254: U14.4 R28.2

## Copper pours and planes (outline as drawn; the poured copper is in the pictures)
GND on Top Layer: -14.87,119.29 103.88,119.29 103.88,-3.39 -14.87,-3.39
GND on Bottom Layer: -18.55,118.02 105.4,118.02 105.4,-2.88 -18.55,-2.88

## Text on the board
Bottom Silkscreen Layer: designed by: Aiden Lim
Top Silkscreen Layer: GND GND +5V +5V | LSP+ LSP- RSP+ RSP- | +12V | +5V | HB_V0
